# EasyEDA Pro project ProDocument_BFMC.pcb_V3.epro

# Board BFMC_2024.pcb
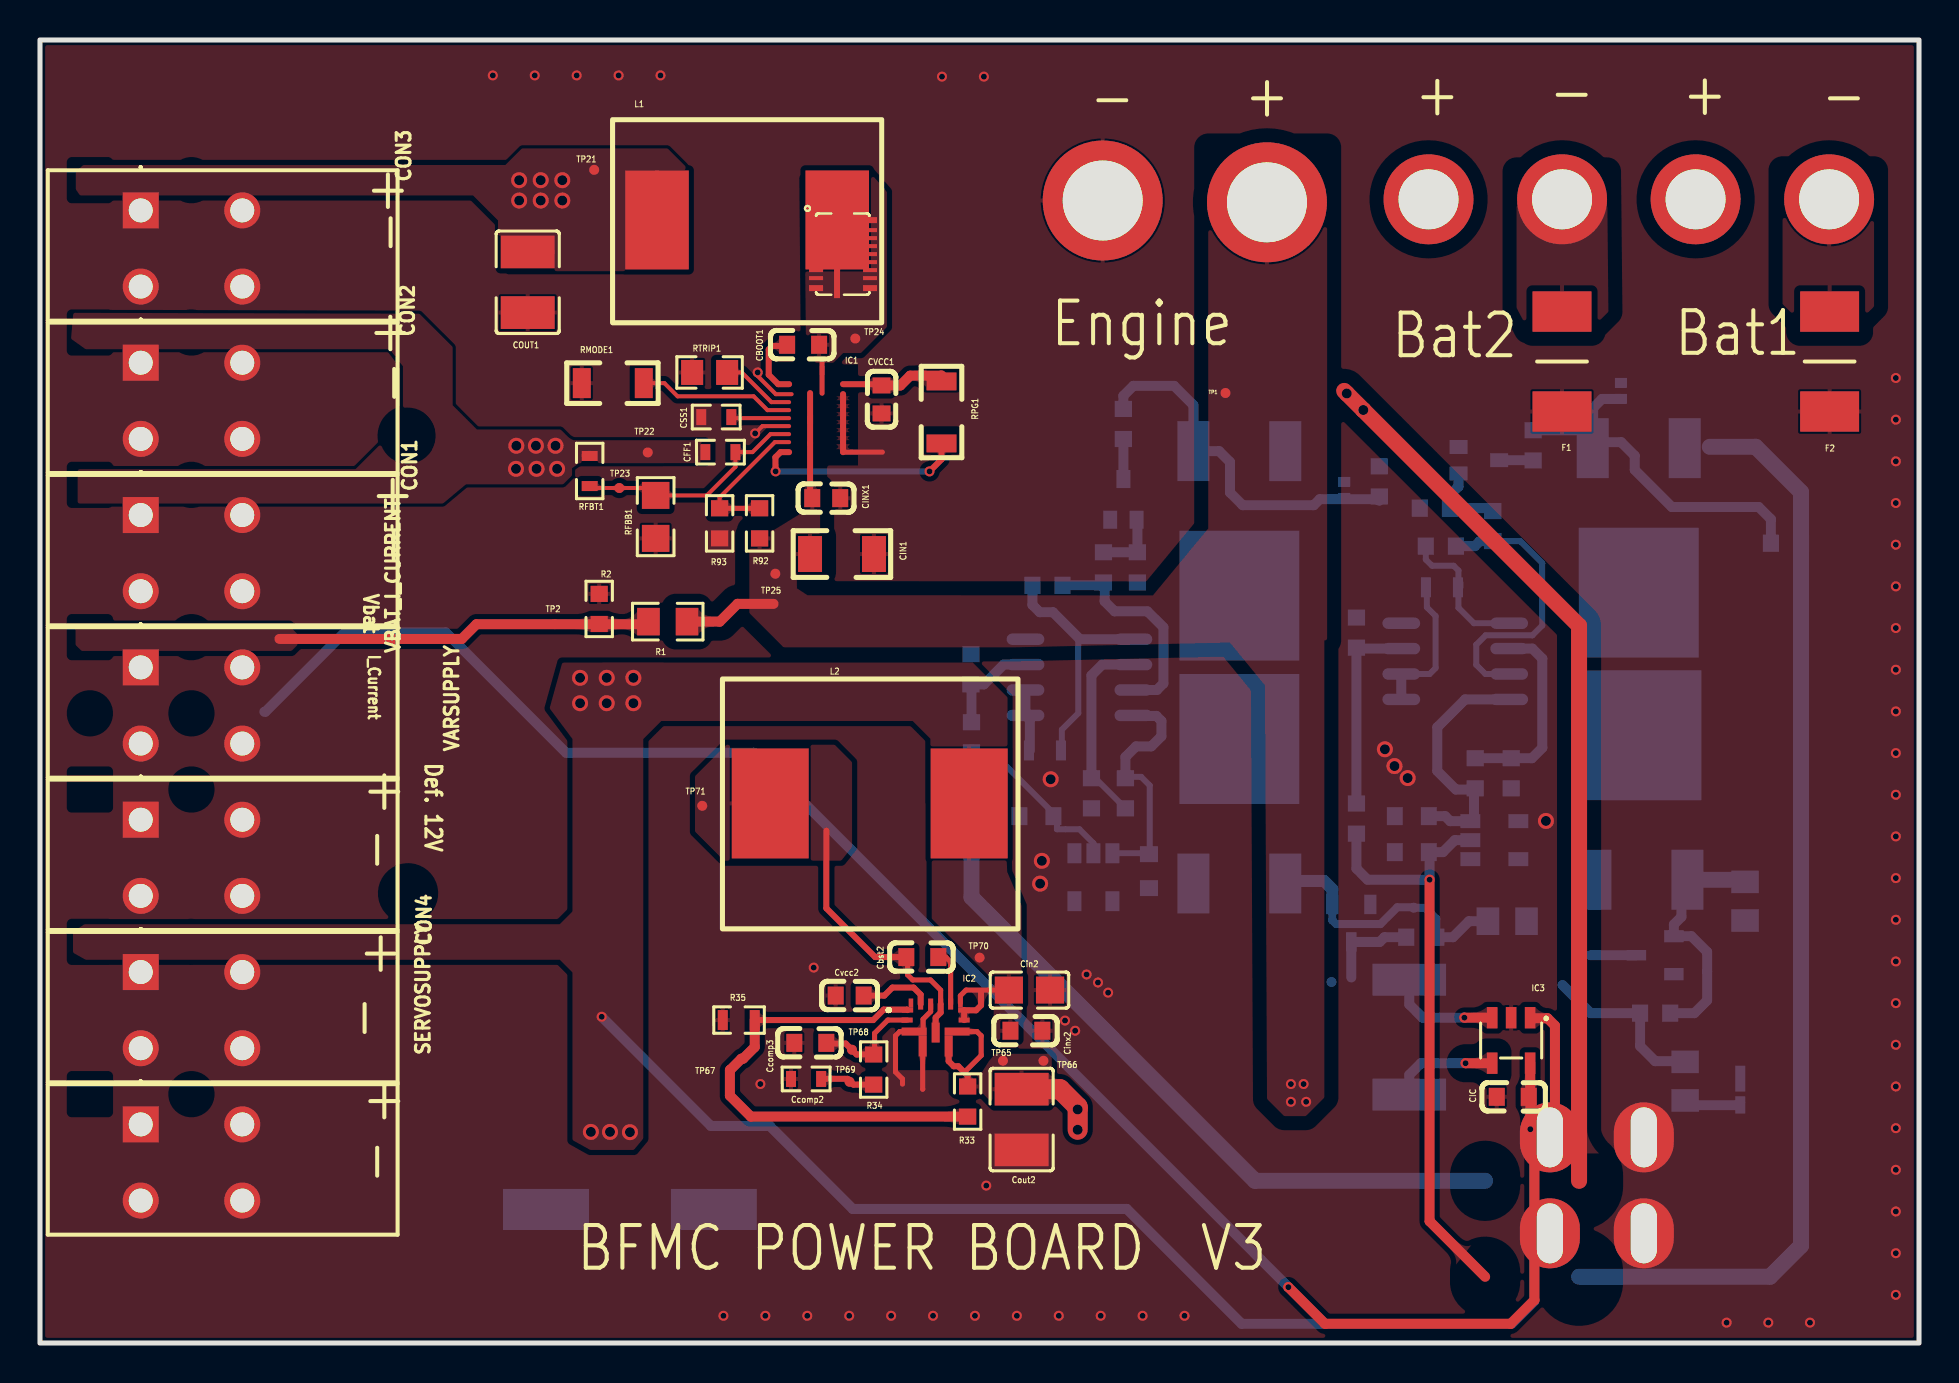
[diagram p0: board, top side]
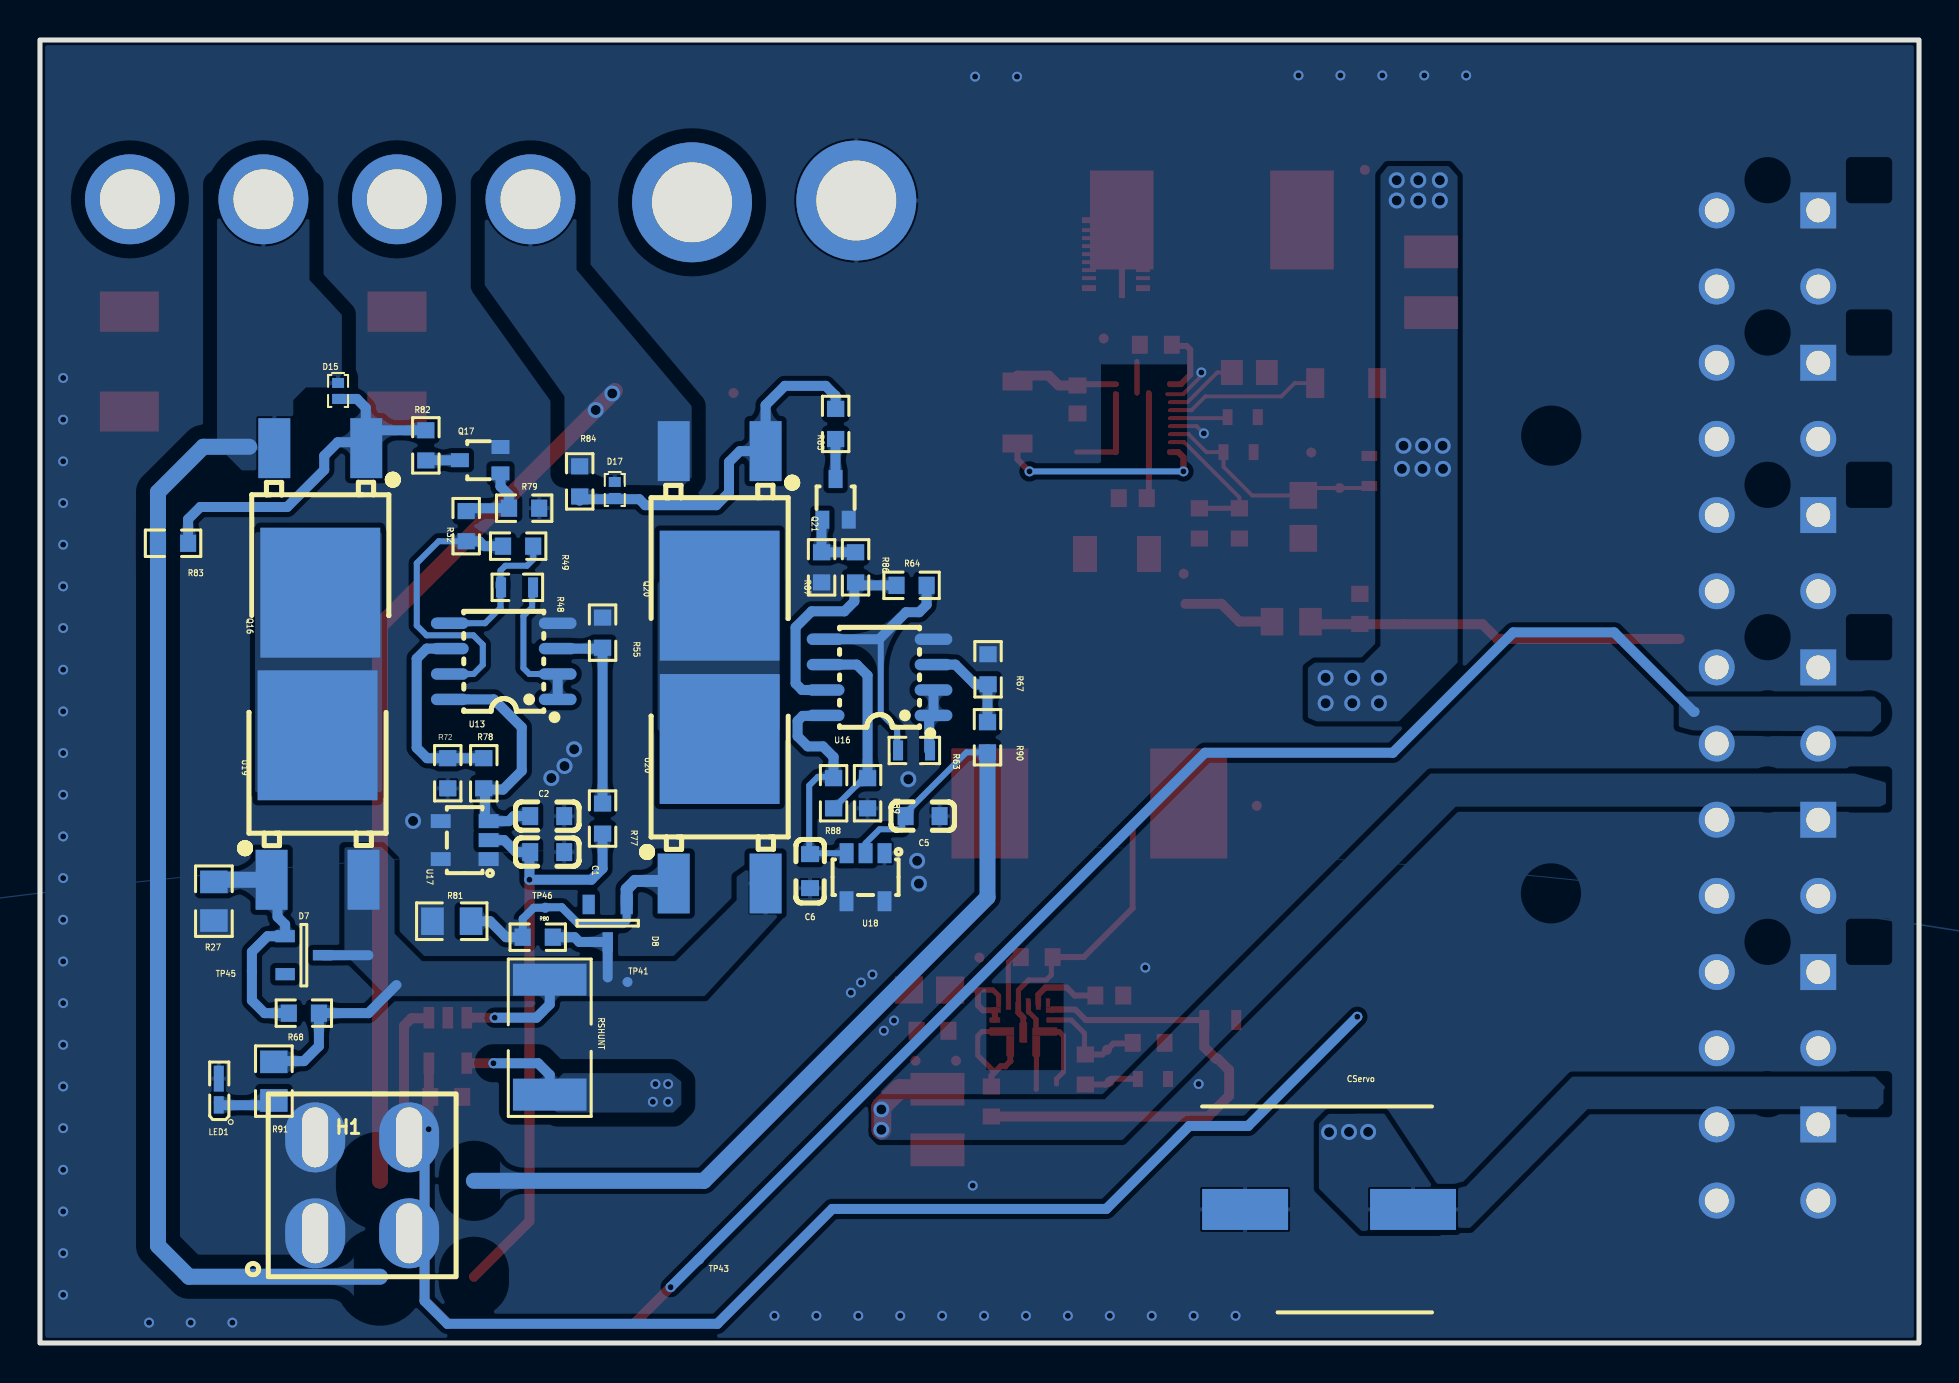
[diagram p1: board, bottom side, seen from below]

Outline 94 x 65.18 mm; copper layers: Top Layer, Bottom Layer. Coordinates in mm from the lower left corner of the outline.
Outline path: rectangle 0,65.18 94,0
Stack: Top Layer 0.035mm - / Dielectric1 1.51mm FR4 er 4.5 / Bottom Layer 0.035mm -

## Design rules (mm)
template: Custom Config
spacing copperThickness1oz (default): track to track 0.102, other pairs 0.152 to 0.3
spacing copperThickness2oz: track to track 0.203, other pairs 0.152 to 0.3
spacing Supply-GND: track to track 0.5, other pairs 0.5 to 0.5
track width copperThickness1oz (default): min 0.127, default 0.254, max 2.54
track width copperThickness2oz: min 0.203, default 0.254, max 2.54
differential pair differentialPair (default): width min 0.127, default 0.254, max 2.54; gap min 0.152, default 0.152
via viaSize (default): diameter min 0.5, default 0.61, max 10; hole min 0.3, default 0.305, max 6.3
['net', 'out batt'] ['NET', 'GND'] uses Supply-GND
['net', 'out batt1'] ['NET', 'GND'] uses Supply-GND
['net', 'out batt2'] ['NET', 'GND'] uses Supply-GND
['net', 'out batt2'] ['NET', '$2N28'] uses Supply-GND
['net', 'out batt1'] ['NET', '$2N30'] uses Supply-GND
['net', 'out batt'] ['NET', 'GND'] uses copperRegion2
['net', 'out batt1'] ['NET', 'GND'] uses copperRegion2
['net', 'out batt2'] ['NET', 'GND'] uses copperRegion2
['net', '$2n28'] ['NET', 'GND'] uses copperRegion2
['net', '$2n30'] ['NET', 'GND'] uses copperRegion2

## Placement (name value [footprint] x y rotation side)
C1  1uf  [c9]  68.68 24.56 180 bottom
C2  1uf  [c9]  68.68 26.36 180 bottom
C5  1uF  [c9]  49.9 26.36 180 bottom
C6  1uF  [c9]  55.48 23.66 270 bottom
CBOOT1  -  [cbst2]  38.08 49.94 0 top
Cbst2  100nF  [Cbst2]  44.04 19.31 0 top
Ccomp2  39nF  [0603 0.5x0.8]  38.32 13.21 0 top
Ccomp3  82pF  [cbst2]  38.44 15.02 0 top
CFF1  C1005C0G1H220J  [0603 0.5x0.8]  34.04 44.56 0 top
CIC  -  [cbst2]  73.78 12.31 180 top
CIN1  -  [cin1 aditome]  40.22 39.47 0 top
Cin2  10uF  [c0805]  49.5 17.65 180 top
CINX1  -  [c0603]  39.33 42.26 0 top
Cinx2  100nF  [cbst2]  49.25 15.62 0 top
CON1  switch  [new connector]  5.04 41.02 270 top
CON2  switch  [new connector]  5.04 48.64 270 top
CON3  switch  [new connector]  5.04 56.26 270 top
CON4  switch  [new connector]  5.04 18.16 270 top
COUT1  -  [c1210]  24.4 53.06 270 top
Cout2  47uF  [c1210]  49.11 11.18 90 top
CServo  -  [capae1030x1050n]  29.51 6.68 180 bottom
CSS1  -  [0603 0.5x0.8]  33.83 46.32 180 top
CVCC1  -  [c0603]  42.1 47.2 270 top
Cvcc2  2.20uF  [c0603]  40.51 17.38 0 top
D7  SZBZX84C18ET1G  [szbzx84c18et1g]  80.8 19.4 270 bottom
D8  SZBZX84C18ET1G  [szbzx84c18et1g]  65.6 21 0 bottom
D15  PZU6.8B2L,315  [dfn1006-2l-rd]  79.09 47.62 270 bottom
D17  PZU6.8B2L,315  [dfn1006-2l-rd]  65.25 42.67 270 bottom
F1  0451015.MRL  [fusc6127x294n]  76.14 49.1 270 top
F2  0451015.MRL  [fusc6127x294n]  89.53 49.1 270 top
H1  switch  [M2021BB1W01]  74.64 5.72 0 bottom
IC1  -  [TPS548B28RWWR]  38.82 46.26 0 top
IC2  -  [TPS61288RQQR]  44.81 15.78 0 top
IC3  INA180A2QDBVRQ1  [ina180a2qdbvrq1]  73.6 15.14 180 top
L1  -  [ihlp4040dzerr47m11]  35.38 56.11 0 top
L2  3.3uH  [dr127-3r3-r (l2)]  41.51 26.99 0 top
LED1  ASCKCG00-NW5X5020302  [ledgreen]  85.06 12.67 90 bottom
NOREF  -  [Pad_e107]  69.46 57.21 0 top
NOREF#2  -  [Pad_e149]  89.5 57.21 0 top
NOREF#3  -  [Pad_e147]  53.16 57.15 0 top
NOREF#4  -  [Pad_e151]  76.14 57.21 0 top
NOREF#5  -  [Pad_e148]  82.82 57.21 0 top
NOREF#6  -  [Pad_e146]  61.38 57.06 0 top
Q16  IPD50P04P413ATMA2  [PG-TO252-3_L6.3-W6.5-P4.57-LS10.0-BR-CW]  79.98 41.15 90 bottom
Q17  BC846W  [sot-323-3_l2.2-w1.3-p1.30-ls2.2-br]  71.98 44.16 180 bottom
Q20  IPD50P04P413ATMA2  [PG-TO252-3_L6.3-W6.5-P4.57-LS10.0-BR-CW]  60 41 90 bottom
Q21  BC846W  [sot-323-3_l2.2-w1.3-p1.30-ls2.2-br]  54.2 42.2 270 bottom
R1  -  [R0805_NEW]  31.4 36.08 0 top
R2  -  [R0603]  27.97 36.72 90 top
R27  -  [r0805_new]  85.3 22.1 270 bottom
R32  -  [R0603]  72.68 40.86 90 bottom
R33  -  [r0603]  46.41 12.08 90 top
R34  -  [R0603]  41.71 13.68 90 top
R35  -  [r35]  34.96 16.16 180 top
R48  2k  [R35]  70.18 37.8 0 bottom
R49  68k  [R0603]  70.08 39.86 0 bottom
R55  36.5k  [r0603]  65.86 35.53 270 bottom
R63  2k  [R35]  50.32 29.64 0 bottom
R64  68k  [R0603]  50.4 37.9 0 bottom
R67  36.5k  [r0603]  46.57 33.7 270 bottom
R68  46.4k  [r0603]  80.8 16.5 180 bottom
R72  75k  [r0603]  73.6 28.5 270 bottom
R77  49.9k  [R0603]  65.86 26.23 270 bottom
R78  49.9k  [R0603]  71.8 28.5 270 bottom
R79  68k  [r0603]  69.78 41.76 0 bottom
R80  46.4k  [r0603]  69.1 20.3 180 bottom
R81  -  [r0805_new]  73.4 21.1 0 bottom
R82  4.7k  [R0603]  74.7 44.9 90 bottom
R83  -  [R0603]  87.34 40 0 bottom
R84  -  [R0603]  67 43.1 90 bottom
R85  4.7k  [R0603]  54.2 45.97 90 bottom
R86  -  [R0603]  53.2 38.8 270 bottom
R87  68k  [r0603]  54.9 38.8 90 bottom
R88  49.9k  [R0603]  54.3 27.5 270 bottom
R89  75k  [r0603]  52.6 27.5 270 bottom
R90  49.9k  [R0603]  46.6 30.3 90 bottom
R91  510  [r0805_new]  82.3 13.1 90 bottom
R92  68k  [r0603]  36 41 270 top
R93  36.5k  [r0603]  34 41 90 top
RFBB1  -  [0805 dany2]  30.8 41.4 270 top
RFBT1  -  [0603 0.5x0.8]  27.5 43.62 270 top
RMODE1  -  [1206r aditome]  28.66 48.02 180 top
RPG1  -  [1206R aditome]  45.1 46.7 90 top
RSHUNT  WSLP25122L500FEA  [wslp25122l000fea bun]  68.5 15.3 270 bottom
RTRIP1  -  [rtrip]  33.62 48.55 180 top
SERVOSUPPLY  switch  [new connector]  5.04 10.54 270 top
TP1  -  [test-point-0.5mm]  59.3 47.52 180 top
TP2  -  [Test-Point-0.5mm]  25.76 35.96 0 top
TP21  -  [test-point-0.5mm]  27.72 58.68 0 top
TP22  -  [test-point-0.5mm]  30.4 44.55 0 top
TP23  -  [Test-Point-0.5mm]  28.98 42.77 90 top
TP24  -  [test-point-0.5mm]  40.79 50.25 270 top
TP25  -  [test-point-0.5mm]  36.79 38.48 0 top
TP41  -  [test-point-0.5mm]  64.61 18.06 180 bottom
TP43  -  [Test-Point-0.5mm]  61.03 4.18 180 bottom
TP45  -  [Test-Point-0.5mm]  83.4 18.6 180 bottom
TP46  -  [Test-Point-0.5mm]  68.73 21.77 180 bottom
TP65  -  [test-point-0.5mm]  48.17 14.12 0 top
TP66  -  [test-point-0.5mm]  50.2 14.12 270 top
TP67  -  [Test-Point-0.5mm]  34.54 13.67 0 top
TP68  -  [Test-Point-0.5mm]  40.62 14.67 0 top
TP69  -  [Test-Point-0.5mm]  40.5 13.07 0 top
TP70  -  [test-point-0.5mm]  47.01 19.28 270 top
TP71  -  [test-point-0.5mm]  33.13 26.87 0 top
U13  LT1490IS8#PBF  [so-8_l4.9-w3.9-p1.27-ls5.9-bl]  70.8 34.1 90 bottom
U16  LT1490IS8#PBF  [so-8_l4.9-w3.9-p1.27-ls5.9-bl]  52 33.3 90 bottom
U17  NCP715SN50T1G  [tsop-5_l3.0-w1.5-p0.95-bl]  72.76 25.16 90 bottom
U18  NCP715SN50T1G  [tsop-5_l3.0-w1.5-p0.95-bl]  52.7 23.3 0 bottom
U19  DMPH3010LK3-13  [PG-TO252-3_L6.3-W6.5-P4.57-LS10.0-BR-CW]  80.11 26.79 270 bottom
U20  DMPH3010LK3-13  [PG-TO252-3_L6.3-W6.5-P4.57-LS10.0-BR-CW]  60 26.6 270 bottom
VARSUPPLY  switch  [new connector]  5.04 25.78 270 top
VBAT_I_CURRENT  switch  [new connector]  5.04 33.4 270 top

## Footprints (pads in the part's own frame, mm; a bottom-side part is the same pattern mirrored in y, then rotated)
0603 0.5x0.8
  rect 0.5x0.8 smd: 1(-0.753,0) 2(0.753,0)
0805 dany2
  rect 1.35x1.377 smd: 1(-1,0) 2(1.15,0)
1206R aditome
  rect 0.9x1.5 smd: 1(-1.7,0) 2(1.4,0)
1206r aditome
  rect 0.9x1.5 smd: 1(-1.55,0) 2(1.55,0)
c9
  rect 0.8x0.9 smd: 1(-0.8,0) 2(0.9,0)
c0603
  rect 0.8x0.9 smd: 1(-0.7,0) 2(0.7,0)
c0805
  rect 1.41x1.35 smd: 1(-1.03,0) 2(1.03,0)
c1210
  rect 1.635x2.7 smd: 1(-1.518,0) 2(1.518,0)
capae1030x1050n
  rect 4.3x2.05 smd: 1(-4.2,0) 2(4.2,0)
Cbst2
  rect 0.8x0.9 smd: 1(-0.7,0) 2(0.9,0)
cbst2
  rect 0.8x0.9 smd: 1(-0.7,0) 2(0.9,0)
cin1 aditome
  rect 1.2x1.8 smd: 1(-1.7,0) 2(1.5,0)
dfn1006-2l-rd
  rect 0.5x0.6 smd: 1(-0.4,0) 2(0.4,0)
dr127-3r3-r (l2)
  rect 3.85x5.5 smd: 1(-4.975,0) 2(4.975,0)
fusc6127x294n
  rect 2.02x2.95 smd: 1(-2.5,0) 2(2.5,0)
ihlp4040dzerr47m11
  rect 3.175x4.953 smd: 1(-4.508,0.064) 2(4.508,0.064)
ina180a2qdbvrq1
  rect 0.532x1.07 smd: 1(-0.95,-1.135) 2(0,-1.135) 3(0.95,-1.135) 4(0.95,1.135) 5(-0.95,1.135)
ledgreen
  rect 1.3x0.5 smd: 1(0.55,0)
  rect 0.87x0.5 smd: 2(-0.765,0)
M2021BB1W01
  oval 3x3.5 hole 1.3x3: 1(0.889,-4.572) 2(5.589,-4.572) 3(0.889,0.228) 4(5.589,0.228)
new connector
  rect 1.8x1.8 hole 1.2: 1(-0.395,0)
  round 1.8 hole 1.2: 2(-0.395,5.08) 3(3.415,0) 4(3.415,5.08)
Pad_e107
  round 4.5 hole 3: 22(0,0)
Pad_e146
  round 6 hole 4: 22(0,0)
Pad_e147
  round 6 hole 4: 22(0,0)
Pad_e148
  round 4.5 hole 3: 22(0,0)
Pad_e149
  round 4.5 hole 3: 22(0,0)
Pad_e151
  round 4.5 hole 3: 22(0,0)
PG-TO252-3_L6.3-W6.5-P4.57-LS10.0-BR-CW
  rect 3x1.6 smd: 1(3.614,-2.3) 3(3.614,2.3)
  rect 6.5x6 smd: 2(-3.614,0.001)
r35
  rect 0.5x1 smd: 1(-0.8,0) 2(0.8,0)
R35
  rect 0.5x1 smd: 1(-0.847,0) 2(0.753,0)
r0603
  rect 0.806x0.864 smd: 1(-0.753,0) 2(0.753,0)
R0603
  rect 0.806x0.864 smd: 1(-0.753,0) 2(0.753,0)
R0805_NEW
  rect 1.133x1.377 smd: 1(-0.966,0) 2(0.966,0)
r0805_new
  rect 1.133x1.377 smd: 1(-0.966,0) 2(0.966,0)
rtrip
  rect 1.1x1.25 smd: 1(-0.753,0) 2(0.997,0)
so-8_l4.9-w3.9-p1.27-ls5.9-bl
  oval 0.574x1.888 smd: 1(-1.905,-2.699) 2(-0.635,-2.699) 3(0.635,-2.699) 4(1.905,-2.699) 5(1.905,2.699) 6(0.635,2.699) 7(-0.635,2.699) 8(-1.905,2.699)
sot-323-3_l2.2-w1.3-p1.30-ls2.2-br
  rect 0.9x0.7 smd: 1(1.016,-0.66) 2(1.016,0.66) 3(-1.016,0)
szbzx84c18et1g
  rect 0.61x0.976 smd: 1(-0.95,-0.938) 2(0.95,-0.938)
  rect 0.522x0.976 smd: 3(0,0.938)
Test-Point-0.5mm
  round 0.5 smd: 1(0,0)
test-point-0.5mm
  round 0.5 smd: 1(0,0)
TPS548B28RWWR
  rect 0.7x0.3 smd: 1(0,9.906) 9(0,6.506) 11(2.7,6.506) 19(2.7,9.906)
  rect 0.7x0.2 smd: 2(0,9.406) 3(0,9.006) 4(0,8.606) 5(0,8.206) 6(0,7.806) 7(0,7.406) 8(0,7.006) 12(2.7,7.006) 13(2.7,7.406) 14(2.7,7.806) 15(2.7,8.206) 16(2.7,8.606) 17(2.7,9.006) 18(2.7,9.406)
  rect 0.3x1.9 smd: 10(1.05,6.956) 20(1.65,9.456) 21(1.05,9.456)
TPS61288RQQR
  rect 0.575x0.25 smd: 1(-1.413,0.875) 7(1.413,0.875)
  rect 0.55x0.25 smd: 2(-1.425,0.375) 6(1.425,0.375)
  rect 1.25x0.4 smd: 3(-1.075,-0.2) 5(1.075,-0.2)
  rect 0.4x1 smd: 4(0,-0.25)
  rect 0.25x0.55 smd: 8(0.75,1.175) 9(0.25,1.175) 10(-0.25,1.175) 11(-0.75,1.175)
  rect 0.225x0.45 smd: 12(-1.237,1.225) 15(1.237,1.225)
  rect 0.4x1.05 smd: 13(-0.65,-0.925) 14(0.65,-0.925)
tsop-5_l3.0-w1.5-p0.95-bl
  rect 0.7x1 smd: 1(-0.95,-1.2) 2(0,-1.2) 3(0.95,-1.2) 4(0.95,1.2) 5(-0.95,1.2)
wslp25122l000fea bun
  rect 1.6x3.68 smd: 1(-2.875,0) 2(2.875,0)

## Nets
+5V: CFF1.1 CIC.1 Cin2.2 Cinx2.1 CON1.1 CON1.2 CON2.1 CON2.2 CON3.1 CON3.2 CON4.1 CON4.2 COUT1.1 CServo.2 IC2.6 IC2.7 IC2.15 IC3.5 L1.1 L2.2 RFBT1.1 SERVOSUPPLY.1 SERVOSUPPLY.2 TP21.1 TP22.1 TP70.1
+VCC2: C2.1 R78.2 U13.8 U17.3
+VCC3: C6.1 R88.1 U16.8 U18.3
GND: C1.2 C2.2 C5.2 C6.2 Ccomp2.1 Ccomp3.1 CIC.2 CIN1.2 Cin2.1 CINX1.2 Cinx2.2 CON1.3 CON1.4 CON2.3 CON2.4 CON3.3 CON3.4 CON4.3 CON4.4 COUT1.2 Cout2.1 CServo.1 CSS1.2 CVCC1.2 Cvcc2.1 F1.2 F2.2 IC1.2 IC1.6 IC1.11 IC1.12 IC1.13 IC1.14 IC1.15 IC1.16 IC1.17 IC1.18 IC2.3 IC2.10 IC2.13 IC3.2 LED1.1 NOREF#3.22 Q17.2 Q21.2 R2.2 R27.2 R35.2 R55.1 R67.1 R72.2 R79.1 R81.2 R87.1 R89.2 R93.1 RFBB1.2 RMODE1.2 RTRIP1.2 SERVOSUPPLY.3 SERVOSUPPLY.4 U13.4 U16.4 U17.1 U17.4 U17.5 U18.1 U18.4 U18.5 VARSUPPLY.3 VARSUPPLY.4
VBATT1: C1.1 H1.3 R77.2 U17.2
VBATT2: C5.1 H1.1 R90.1 U18.2
VCC: CVCC1.1 IC1.19 RPG1.2
VCCBOOST: Cvcc2.2 IC2.11
ADC1: R1.1 R2.1 TP2.1 VBAT_I_CURRENT.1 VBAT_I_CURRENT.2
BOOT: CBOOT1.1 IC1.1
BST: Cbst2.2 IC2.8
COMP: Ccomp3.2 IC2.2 R34.2 TP68.1
EN: IC1.8 R92.1 R93.2
FB: CFF1.2 IC1.7 RFBB1.1 RFBT1.2 TP23.1
FB_1: IC2.1 IC2.12 R33.1 R35.1 TP67.1
ISHUNT: IC3.1 TP43.1 VBAT_I_CURRENT.3 VBAT_I_CURRENT.4
MODE: IC1.4 RMODE1.1
OUT_BATT: CIN1.1 CINX1.1 IC1.10 IC1.21 IC3.4 NOREF#6.22 R1.2 R92.2 RSHUNT.2 TP1.1 TP25.1
OUT_BATT1: D15.1 H1.4 NOREF#5.22 Q16.3 R83.2
OUT_BATT2: D17.1 H1.2 NOREF.22 Q20.3 R84.2
PGOOD: IC1.9 RPG1.1
SS_REFIN: CSS1.1 IC1.5
SW: CBOOT1.2 IC1.20 L1.2 TP24.1
SW_1: Cbst2.1 IC2.4 IC2.9 L2.1 TP71.1
TRIP: IC1.3 RTRIP1.1
UBATT: D7.3 D8.3 IC3.3 R68.2 R80.2 R91.2 RSHUNT.1 TP41.1 U19.3 U20.3
VOUT1: Cout2.2 IC2.5 IC2.14 R33.2 TP65.1 TP66.1 VARSUPPLY.1 VARSUPPLY.2
$1N1788: D8.1 R80.1 R81.1 TP46.1 U20.1
$1N1798: D7.1 R27.1 R68.1 TP45.1 U19.1
$1N2164: Q16.2 U19.2
$1N2337: D15.2 Q16.1 R82.2 R83.1
$1N2412: Q17.3 R82.1
$1N2516: Q17.1 R32.2 R79.2
$1N20674: R55.2 R77.1 U13.3
$1N20931: R48.1 U13.1 U13.2
$1N20946: R48.2 R49.1 U13.5
$1N20962: R32.1 R49.2 U13.7
$1N21052: R72.1 R78.1 U13.6
$1N27791: Q20.2 U20.2
$1N27792: D17.2 Q20.1 R84.1 R85.2
$1N27793: Q21.3 R85.1
$1N27799: Q21.1 R86.1 R87.2
$1N27802: R63.1 U16.1 U16.2
$1N27807: R63.2 R64.1 U16.5
$1N27811: R64.2 R86.2 U16.7
$1N27822: R67.2 R90.2 U16.3
$1N32332: R88.2 R89.1 U16.6
$1N40141: LED1.2 R91.1
$2N28: F1.1 NOREF#4.22
$2N30: F2.1 NOREF#2.22
$3N2936: Ccomp2.2 R34.1 TP69.1

Pads without a net: D7 2; D8 2

## Via types
v1: diameter 0.5, hole 0.3, Top Layer to Bottom Layer, 67 vias
v2: diameter 0.8, hole 0.5, Top Layer to Bottom Layer, 32 vias

## Routing (per net, layer and track width the routed paths; a pad name or vN(x,y) marks a point on that pad's centre or on a via; arc(x,y) is an arc through that point)
+5V: length 70.6
  Top Layer w0.254: IC2.15 46.04,17.37 46.33,17.65 Cin2.2
  Top Layer w0.3: 46.23,16.64 IC2.7 ; 46.23,16.64 46.83,16.64 47.08,16.89 47.08,17.58 47.07,17.59 ; 46.23,16.64 IC2.6
  Top Layer w0.5: v1(74.56,10.69) 74.56,12.36 74.48,12.44 74.55,12.5 IC3.5
  Bottom Layer w0.5: v1(28.1,16.32) 33.56,10.86 36.51,10.86 40.66,6.71 54.37,6.71 60.11,0.96 73.62,0.96 74.76,2.1 74.76,10.49 v1(74.56,10.69)
  vias: v2(23.83,44.88) v2(23.81,43.73) v2(23.97,58.17) v2(23.97,57.15) v2(24.81,44.88) v2(24.84,43.73) v2(25.05,58.17) v2(25.05,57.15) v2(25.79,44.88) v2(25.87,43.73) v2(26.13,58.17) v2(26.13,57.15) v2(27.02,33.27) v2(27.02,32) v2(27.56,10.56) v2(28.35,33.27) v2(28.35,32) v2(28.52,10.56) v2(29.51,10.55) v2(29.69,33.27) v2(29.69,32)
+VCC2: length 12.5
  Bottom Layer w0.5: C2.1 70.3,26.36 70.55,26.11 U17.3 71.74,26.29 71.74,27.69 ; 71.74,27.69 R78.2 ; 71.74,27.69 70.83,27.69 69.9,28.62 69.9,30.8 71.29,32.19 U13.8
+VCC3: length 12.3
  Bottom Layer w0.3: R88.1 54.37,28.32 55.09,28.32 55.52,27.89 55.52,24.5 U18.3
  Bottom Layer w0.5: R88.1 54.3,29.31 54.83,29.84 55.59,29.84 56.1,30.35 56.1,31.11 55.85,31.37 54.72,31.37 U16.8
GND: length 16.7
  Top Layer w0.2: 37.47,45.86 36.14,45.86 v1(35.78,45.5) ; 35.9,48.55 35.9,48.37 36.81,47.46 37.6,47.46
  Top Layer w0.254: IC2.13 44.16,12.7 44.16,12.7 ; IC2.10 44.56,16.58 44.18,16.2 44.18,15.58 IC2.3 43.01,15.58 42.8,15.37 42.8,13.56 43.15,13.21 43.15,12.95 ; 40.17,44.56 42.14,44.56
  Top Layer w0.3: 40.17,44.56 40.17,47.46
  vias: v1(22.65,63.41) v1(24.75,63.41) v1(26.85,63.41) v1(28.94,63.41) v1(31.04,63.41) v1(34.19,1.36) v1(35.9,48.55) v1(36.04,12.95) v1(36.29,1.36) v1(38.38,1.36) v1(38.71,18.78) v1(40.48,1.36) v1(42.58,1.36) v1(44.68,1.36) v1(45.12,63.35) v1(46.77,1.36) v1(47.22,63.35) v1(47.34,7.87) v1(48.87,1.36) v1(50.97,1.36) v1(51.28,16.13) v1(51.79,15.62) v1(52.36,18.44) v1(52.93,18.03) v1(53.06,1.36) v1(53.43,17.53) v1(55.16,1.36) v1(57.26,1.36) v1(84.37,1.02) v1(86.46,1.02) v1(88.54,1.02) v1(92.84,48.27) v1(92.84,46.19) v1(92.84,44.1) v1(92.84,42.02) v1(92.84,39.93) v1(92.84,37.85) v1(92.84,35.76) v1(92.84,33.68) v1(92.84,31.59) v1(92.84,29.51) v1(92.84,27.43) v1(92.84,25.34) v1(92.84,23.26) v1(92.84,21.17) v1(92.84,19.09) v1(92.84,17) v1(92.84,14.92) v1(92.84,12.83) v1(92.84,10.75) v1(92.84,8.66) v1(92.84,6.58) v1(92.84,4.49) v1(92.84,2.41) v2(50.03,22.98) v2(50.12,24.12) v2(50.56,28.2) v2(67.28,29.7) v2(67.76,28.86) v2(68.42,28.26) v2(75.34,26.11)
VBATT1: length 30.4
  Top Layer w0.5: v1(69.52,23.17) 69.52,6.09 72.29,3.31
  Bottom Layer w0.5: U17.2 70.78,25.16 70.18,24.56 C1.1 69.52,24.56 v1(69.52,23.17) 66.42,23.17 65.86,23.73 R77.2
VBATT2: length 47.7
  Bottom Layer w0.3: U18.2 52.7,25 52,25.7 50.87,25.7 50.87,26.33 47.65,29.55 R90.1
  Bottom Layer w0.8: R90.1 46.6,22.3 60.78,8.12 72.29,8.12
VCC: length 5.2
  Top Layer w0.3: 40.17,47.96 42.04,47.96 CVCC1.1
  Top Layer w0.5: 45.1,48.4 45.09,48.39 43.53,48.39 43.04,47.9 CVCC1.1
VCCBOOST: length 3.6
  Top Layer w0.3: Cvcc2.2 42.24,17.38 42.64,17.78 43.71,17.78 44.06,17.43 IC2.11
ADC1: length 18.8
  Top Layer w0.5: R1.1 30.31,35.95 27.96,35.95 ; 27.96,35.95 21.83,35.95 21.1,35.22 11.98,35.22 ; 27.96,35.95 R2.1
BOOT: length 3.4
  Top Layer w0.3: 37.47,47.96 36.93,47.96 36.46,48.44 36.46,49.69 36.64,49.88 37.26,49.88 37.32,49.94
BST: length 2.8
  Top Layer w0.254: IC2.8 45.56,19.06 45.31,19.31 Cbst2.2
COMP: length 5.6
  Top Layer w0.254: IC2.2 42.41,16.15 41.75,15.49 41.75,14.48 R34.2
  Top Layer w0.3: Ccomp3.2 39.37,14.98 40.31,14.98 40.85,14.43 R34.2
EN: length 7.2
  Top Layer w0.2: R93.2 34,42.3 36.76,45.06 37.47,45.06
  Top Layer w0.254: R93.2 R92.1
FB: length 11.9
  Top Layer w0.2: 37.47,45.46 36.54,45.46 35.64,44.56 CFF1.2 34.79,43.83 33.36,42.4 RFBB1.1 30.43,42.77 TP23.1 27.78,42.77 27.68,42.87 RFBT1.2
FB_1: length 24.4
  Top Layer w0.3: R35.1 41.68,16.16 42.21,16.68 43.37,16.68 IC2.1
  Top Layer w0.5: 46.31,11.33 35.56,11.33 34.51,12.37 34.51,13.65 TP67.1 35.09,14.22 35.18,14.22 35.76,14.8 R35.1
ISHUNT: length 95.6
  Top Layer w0.5: v1(62.45,2.79) 64.29,0.96 73.57,0.96 74.76,2.15 74.76,9.46 75.79,10.49 75.79,15.88 75.41,16.25 74.57,16.25
  Bottom Layer w0.3: 61.07,4.18 TP43.1
  Bottom Layer w0.5: 11.22,31.58 11.28,31.58 15.25,35.55 20.3,35.55 26.32,29.53 35.72,29.53 v1(62.45,2.79)
MODE: length 7.8
  Top Layer w0.2: 37.47,46.66 36.39,46.66 35.7,47.36 31.9,47.36 31.24,48.02 RMODE1.1
OUT_BATT: length 15.4
  Top Layer w0.3: CINX1.1 38.52,42.37 38.52,47.51
  Top Layer w0.5: v1(71.32,14) 72.64,14 IC3.4 ; R1.2 34.01,36.08 34.9,36.97 36.7,36.97
  Bottom Layer w0.5: RSHUNT.2 68.5,13.41 69.08,14 v1(71.32,14)
  vias: v1(62.58,12.95) v1(62.58,12.06) v1(63.21,12.95) v1(63.34,12.06)
OUT_BATT1: length 54.9
  Bottom Layer w0.8: 83.53,44.83 85.83,44.83 88.1,42.56 R83.2 88.1,4.87 86.54,3.31 76.99,3.31
OUT_BATT2: length 44.4
  Top Layer w0.8: 76.99,8.12 76.99,35.88 v2(66.2,46.67) 65.25,47.62
  vias: v2(65.37,47.5)
PGOOD: length 10.8
  Top Layer w0.3: 36.79,43.62 36.79,44.31 37.05,44.56 37.47,44.56 ; RPG1.1 45.1,44.2 v1(44.5,43.6)
  Bottom Layer w0.3: v1(44.5,43.6) v1(36.8,43.6)
SS_REFIN: length 3
  Top Layer w0.2: 34.53,46.38 34.65,46.26 37.47,46.26
SW: length 1.6
  Top Layer w0.254: 39.12,47.51 39.12,49.1
SW_1: length 14
  Top Layer w0.254: IC2.9 45.06,17.65 44.55,18.16 43.66,18.16 43.4,18.42 43.4,19.24 Cbst2.1
  Top Layer w0.3: 39.34,25.63 39.34,21.75 41.78,19.31 Cbst2.1 ; IC2.4 44.81,16.28 45.06,16.53 IC2.9
TRIP: length 3.6
  Top Layer w0.2: 37.47,47.06 36.59,47.06 35.11,48.55 34.48,48.55 34.46,48.53
UBATT: length 21.3
  Top Layer w0.5: v1(71.26,16.28) 72.64,16.28 IC3.3
  Bottom Layer w0.5: R80.2 67.26,20.3 67.02,20.06 D8.3 65.6,18.29 ; 79.86,19.4 77.56,19.4 ; 76.17,17.91 77.57,16.5 R68.2 80.05,14.85 80.8,14.1 82.27,14.1 R91.2 ; v1(71.26,16.28) 69.16,16.28 68.5,16.94 RSHUNT.1
VOUT1: length 10.3
  Top Layer w0.254: 46.24,13.54 47.08,14.38 47.08,15.37 46.87,15.58 IC2.5
  Top Layer w0.3: IC2.14 45.46,14.1 45.71,13.84 45.94,13.84 46.41,13.38 R33.2
  Top Layer w1: Cout2.2 51.02,12.7 51.91,11.81 v2(51.91,11.68) v2(51.91,10.67)
$1N1788: length 13.8
  Bottom Layer w0.4: R80.1 69.85,21.22 69.3,21.77 TP46.1 68.7,21.8 67.9,21.8 67.06,20.95 64.84,20.95 64.65,21.14 D8.1
  Bottom Layer w0.5: R80.1 70.69,20.3 71.49,21.1 R81.1
  Bottom Layer w0.6: D8.1 64.65,22.7 64.24,23.11 62.43,23.11 U20.1
$1N1798: length 12.6
  Bottom Layer w0.5: R68.1 82.76,16.5 83.4,17.14 TP45.1 83.4,19.56 82.61,20.35 D7.1 81.74,20.94 82.11,21.31 82.11,22.87 U19.1
  Bottom Layer w0.8: R27.1 85.19,23.17 U19.1
$1N2337: length 19.3
  Bottom Layer w0.5: 77.7,45.06 77.7,46.78 78.15,47.22 D15.2 ; 77.7,45.06 79.1,45.06 79.78,44.38 79.78,43.67 81.63,41.82 85.98,41.82 86.59,41.21 R83.1 ; 77.7,45.06 77.7,44.78 Q16.1 77.68,45.12 77.14,45.66 R82.2
$1N2412: length 1.7
  Bottom Layer w0.5: Q17.3 74.68,44.16 R82.1
$1N2516: length 4
  Bottom Layer w0.5: Q17.1 70.96,42.84 70.53,42.41 R79.2 72.43,41.76 72.58,41.61
$1N20674: length 10
  Bottom Layer w0.5: R77.1 65.86,34.72 65.87,34.73 U13.3
$1N20931: length 7.6
  Bottom Layer w0.3: U13.2 69.52,33.47 69.82,33.77 69.82,36.37 69.38,36.8 69.38,38.04
  Bottom Layer w0.5: U13.1 U13.2
$1N20946: length 7.3
  Bottom Layer w0.3: 70.98,37.8 70.96,37.82 70.96,36.78 71.73,36 U13.5 ; 70.96,38.02 70.96,38.64 70.72,38.88 69.64,38.88 69.33,39.19 R49.1
  Bottom Layer w0.5: 70.96,38.02 70.96,37.82
$1N20962: length 14.5
  Bottom Layer w0.3: U13.7 72.31,33.47 71.85,33.92 71.85,34.93 72.32,35.4 74.66,35.4 75.15,35.89 75.15,39.01 74.05,40.11 R32.1
  Bottom Layer w0.5: R32.1 72.03,40.11 71.78,39.86 R49.2
$1N21052: length 9.9
  Bottom Layer w0.5: R78.1 R72.1 74.63,29.25 75.16,29.78 75.16,34.23 74.66,34.73 U13.6
$1N27792: length 18.5
  Bottom Layer w0.5: 67,42.13 66.92,42.21 64.02,42.21 63.72,41.91 60.17,41.91 59.53,42.55 59.53,44.07 58.99,44.61 Q20.1 57.7,46.92 56.74,47.88 54.7,47.88 54.2,47.38 R85.2
$1N27793: length 2
  Bottom Layer w0.5: R85.1 54.2,45.22 Q21.3
$1N27799: length 3.3
  Bottom Layer w0.5: R86.1 R87.2 54.9,41.14 Q21.1
$1N27802: length 3.1
  Bottom Layer w0.5: U16.2 U16.1 49.52,31.18 49.52,29.64
$1N27807: length 12.6
  Bottom Layer w0.3: U16.5 54.69,35.2 ; 51.12,29.64 51.12,30.68 51.94,31.5 51.94,35.2
  Bottom Layer w0.5: R64.1 49.65,36.92 50.02,36.56 50.68,36.56 52.03,35.2 U16.5
$1N27811: length 11
  Bottom Layer w0.3: 53.05,37.9 R86.2
  Bottom Layer w0.5: U16.7 55.87,32.67 56.2,32.99 56.2,35.8 55.4,36.6 53.76,36.6 53.26,37.1 53.26,37.9 R64.2
$1N27822: length 4.9
  Bottom Layer w0.3: 46.6,32.85 46.7,32.95
  Bottom Layer w0.5: 46.7,32.95 47.22,32.95 48.21,33.94 U16.3 ; R90.2 46.6,32.85
$1N32332: length 9.8
  Bottom Layer w0.3: R88.2 52.79,28.25 R89.1
  Bottom Layer w0.5: R89.1 52.6,33.39 53.14,33.94 U16.6
$1N40141: length 2.9
  Bottom Layer w0.5: R91.1 82.54,11.9 84.92,11.9 85.06,12.03
$3N2936: length 2.8
  Top Layer w0.3: R34.1 40.69,12.93 40.4,13.22 39.02,13.22

## Copper pours and planes (outline as drawn; the poured copper is in the pictures)
+5V on Top Layer: 23.02,58.52 24.16,59.66 31.36,59.66 32.2,58.81 32.2,53.71 23.47,53.71 23.02,54.18
+5V on Top Layer: 15.83,43.61 18.7,46.48 20.22,46.48 21.87,44.83 21.87,43.56 20.12,42.09 1.99,42.09 1.99,43.61
+5V on Top Layer: 1.8,58.57 2.16,58.93 26.84,58.93 27.39,58.38 27.39,56.63 26.76,56.01 23.06,56.01 21.66,57.4 2,57.4 1.8,57.71
+5V on Top Layer: 26.13,34.04 31.21,34.04 31.84,33.4 31.84,31.88 30.18,30.21 30.18,10.23 29.71,9.66 27.53,9.66 26.64,10.15 26.64,30.21 25.49,31.75
+5V on Top Layer: 27.4,31.62 27.4,33.68 28.16,34.04 46.67,34.04 48.4,32.3 48.4,27.86 47.08,26.54 45.05,26.54 44.54,27.05 44.54,30.23 43.66,31.11 28.17,31.11
+5V on Top Layer: 1.76,51.43 18.94,51.39 20.54,49.78 20.54,46.86 21.81,45.59 26,45.59 26.51,45.09 26.51,43.44 26.13,43.05 21.31,43.05 18.26,46.1 18.26,48.89 17.54,49.82 2.32,49.82 1.66,50.28
+5V on Top Layer: 44.61,27.41 48.23,27.18 48.39,23.56 49.11,21.88 49.11,16.34 48.89,16.03 48.89,15.35 48.68,15.15 47.91,15.15 47.71,15.35 47.71,18.13 44.61,21.23
+5V on Top Layer: 33.27,45.06 33.47,44.85 33.47,44.31 33.28,44.11 26.92,44.11 26.4,43.73 26.4,45.2 26.65,45.06
+5V on Top Layer: 1.65,20.58 2.23,20.95 26,20.95 27.4,22.35 27.4,18.03 27.27,17.91 26,19.17 2.28,19.17 1.65,19.52
+5V on Bottom Layer: 28.22,11.46 29.54,11.46 30.02,10.98 30.02,7.73 27.89,5.61 24.05,5.61 24.05,7.41 26.75,11.48 28.2,11.48
+5V on Bottom Layer: 23.52,58.87 26.58,58.87 26.95,58.42 26.95,34.87 27.78,34.04 30.22,34.04 30.57,33.78 30.57,31.28 30.14,31.1 26.02,31.1 23.08,34.04 23.08,58.37
+5V on Bottom Layer: 1.66,12.78 2.2,13.32 17.35,13.32 22.65,7.85 26.81,6.75 26.81,5.76 22.46,5.76 16.58,11.7 2.08,11.7 1.78,12 1.78,12.66
GND on Top Layer: -16.62,69.9 101.64,69.9 101.64,-8.58 -16.62,-8.58
GND on Bottom Layer: 53.99,40.73 53.96,40.66 53.89,40.63 53.19,40.63 53.12,40.66 53.09,40.73 53.09,41.63 53.12,41.71 53.19,41.74 53.89,41.74 53.96,41.71 53.99,41.63
GND on Bottom Layer: 53.99,40.73 53.96,40.66 53.89,40.63 53.19,40.63 53.12,40.66 53.09,40.73 53.09,41.63 53.12,41.71 53.19,41.74 53.89,41.74 53.96,41.71 53.99,41.63
GND on Bottom Layer: 53.19,40.63 53.12,40.66 53.09,40.73 53.09,41.63 53.12,41.71 53.19,41.74 53.89,41.74 53.96,41.71 53.99,41.63 53.99,40.73 53.96,40.66 53.89,40.63
GND on Bottom Layer: -18.9,73.44 100.86,73.44 100.86,-16.5 -18.9,-16.5
GND on Bottom Layer: 53.99,40.73 53.96,40.66 53.89,40.63 53.19,40.63 53.12,40.66 53.09,40.73 53.09,41.63 53.12,41.71 53.19,41.74 53.89,41.74 53.96,41.71 53.99,41.63
ADC1 on Top Layer: 1.78,35.88 12.46,35.88 12.88,35.46 12.88,34.92 12.58,34.62 2.08,34.62 1.78,34.92
ISHUNT on Bottom Layer: 2.24,32.34 11.7,32.34 12.02,31.96 12.02,30.83 11.3,30.64 2.39,30.59 1.9,31.08 1.9,32.04
OUT_BATT on Top Layer: 64.39,59.8 64.39,35.15 48.72,34.8 37.2,34.8 35.48,36.52 35.48,40.41 35.74,40.67 36.72,40.67 38.18,41.57 38.18,42.36 38.32,42.55 38.95,42.54 39.03,42.46 39.03,39.1 37.86,38.39 37.87,37.75 38.39,37.41 55.67,37.4 58.45,40.75 58.45,59.8
OUT_BATT on Top Layer: 64.25,12.28 64.25,36.44 58.42,36.38 61.28,32.89 61.38,12.21 62.24,11.35 63.32,11.35
OUT_BATT on Bottom Layer: 61.92,11.92 62.31,11.53 68.11,11.53 68.81,11.91 68.81,12.51 67.82,13.5 62.44,13.5 61.92,13.08
OUT_BATT1 on Bottom Layer: 78.9,47.8 78.9,51.44 80.52,53.18 80.52,57.95 85.14,57.95 85.14,44.89 83.9,43.65 81.33,43.65 81.33,47.17 80.7,47.8
OUT_BATT2 on Bottom Layer: 67.16,58.02 71.75,58.02 71.75,52.92 67.76,47.35 67.76,43.48 66.32,43.51 64.96,42.92 61.81,42.89 61.4,43.3 61.4,46.86 67.16,53.69
SW on Top Layer: 38.78,49.03 39.69,49.04 40.18,49.52 41.06,49.52 42.37,50.83 42.37,57.58 41.54,58.54 38.48,58.54 38.24,58.25 38.31,50.41
SW_1 on Top Layer: 34.34,29.93 39.76,29.93 40.63,29.05 40.63,24.82 40.08,24.13 34.22,24.13 32.77,25.58 32.77,28.36
UBATT on Bottom Layer: 56.98,23.8 56.98,21.45 60.75,17.35 76.65,17.35 78.77,19.47 78.77,24.8 76.9,24.8 76.26,24.16 76.26,20.48 74.88,19.1 62.2,19.1 59.15,22.15 59.15,23.32 58.48,23.8
VOUT1 on Top Layer: 45.75,13.46 47.07,13.46 47.47,14.1 47.78,14.47 50.44,14.47 50.62,14.29 50.62,12.3 50.29,11.98 47.65,11.98 47.17,12.48 45.81,12.48 45.71,12.58 45.71,13.42
VOUT1 on Bottom Layer: 52.29,10.46 52,10.16 39.85,10.16 23.18,26.83 1.96,26.83 1.65,26.97 1.65,28.04 3.22,28.49 24.44,28.49 40.73,12.19 52.04,12.19 52.29,11.94
$1N2164 on Bottom Layer: 76.9,40.56 83.24,40.56 83.24,27.54 76.9,27.54
$1N27791 on Bottom Layer: 57.2,38.4 62.7,38.4 63.1,38 63.1,30.7 63,30.6 57.1,30.6 57,30.5 57,38.2
$2N28 on Top Layer: 73.87,58.61 78.39,58.61 78.46,51.58 77.58,50.7 74.44,50.7 73.87,51.78
$2N30 on Top Layer: 87.17,58.66 91.75,58.66 91.75,51.85 90.64,50.73 88.41,50.73 87.17,51.97

Small or netless copper shapes (teardrops, artwork), in the pictures only: 83 on Top Layer, 118 on Bottom Layer

## Text on the board
Top Silkscreen Layer: I_Current | Vbat | Def. 12V | - | _ | + | Engine | Bat2 | Bat1 | BFMC POWER BOARD  V3
